# EAGLE schematic AR0130_DEV_BOARD (EAGLE 9.2.2)
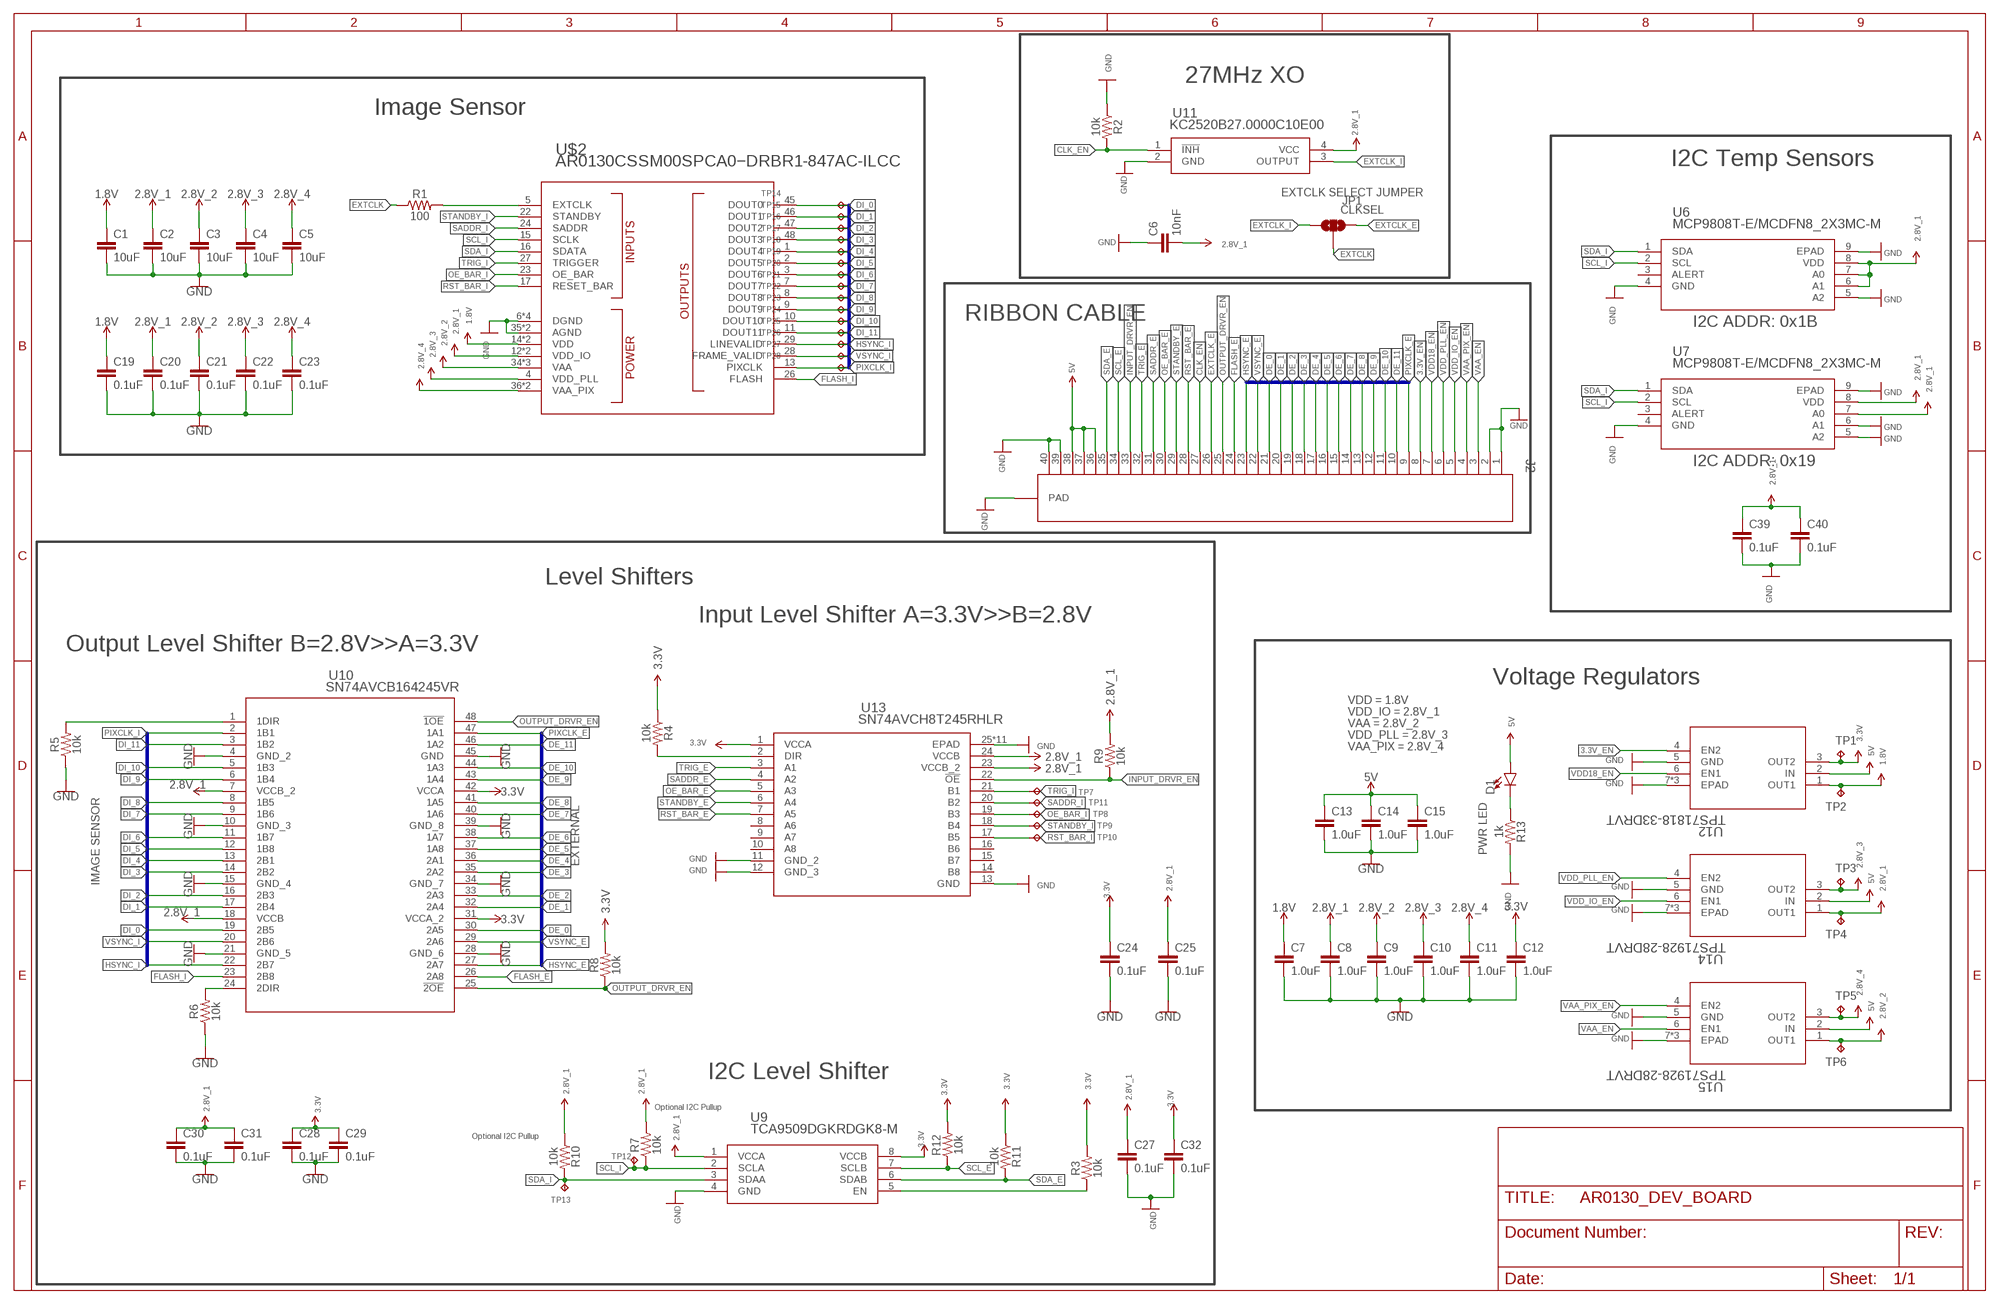
[diagram p0: schematic, sheet 1]

## Parts
C1  10uF  10UF-0603-6.3V-20%  [0603]
C2  10uF  10UF-0603-6.3V-20%  [0603]
C3  10uF  10UF-0603-6.3V-20%  [0603]
C4  10uF  10UF-0603-6.3V-20%  [0603]
C5  10uF  10UF-0603-6.3V-20%  [0603]
C6  10nF  10NF-0402-16V-10%  [0402]
C7  1.0uF  1.0UF-0402-16V-10%  [0402]
C8  1.0uF  1.0UF-0402-16V-10%  [0402]
C9  1.0uF  1.0UF-0402-16V-10%  [0402]
C10  1.0uF  1.0UF-0402-16V-10%  [0402]
C11  1.0uF  1.0UF-0402-16V-10%  [0402]
C12  1.0uF  1.0UF-0402-16V-10%  [0402]
C13  1.0uF  1.0UF-0402-16V-10%  [0402]
C14  1.0uF  1.0UF-0402-16V-10%  [0402]
C15  1.0uF  1.0UF-0402-16V-10%  [0402]
C19  0.1uF  0.1UF-0402-16V-10%  [0402]
C20  0.1uF  0.1UF-0402-16V-10%  [0402]
C21  0.1uF  0.1UF-0402-16V-10%  [0402]
C22  0.1uF  0.1UF-0402-16V-10%  [0402]
C23  0.1uF  0.1UF-0402-16V-10%  [0402]
C24  0.1uF  0.1UF-0402-16V-10%  [0402]
C25  0.1uF  0.1UF-0402-16V-10%  [0402]
C27  0.1uF  0.1UF-0402-16V-10%  [0402]
C28  0.1uF  0.1UF-0402-16V-10%  [0402]
C29  0.1uF  0.1UF-0402-16V-10%  [0402]
C30  0.1uF  0.1UF-0402-16V-10%  [0402]
C31  0.1uF  0.1UF-0402-16V-10%  [0402]
C32  0.1uF  0.1UF-0402-16V-10%  [0402]
C39  0.1uF  0.1UF-0402-16V-10%  [0402]
C40  0.1uF  0.1UF-0402-16V-10%  [0402]
D1  LED0603  [LED-0603]
J2  4-1734592-04-1734592-0  [TE_4-1734592-0]
JP1  CLKSEL  SOLDERJUMPER_2WAYPASTE1&2  [SJ_3_PASTE1&2]
R1  100  RESISTOR0402  [0402]
R2  10k  RESISTOR0402  [0402]
R3  10k  RESISTOR0402  [0402]
R4  10k  RESISTOR0402  [0402]
R5  10k  RESISTOR0402  [0402]
R6  10k  RESISTOR0402  [0402]
R7  10k  RESISTOR0402  [0402]
R8  10k  RESISTOR0402  [0402]
R9  10k  RESISTOR0402  [0402]
R10  10k  RESISTOR0402  [0402]
R11  10k  RESISTOR0402  [0402]
R12  10k  RESISTOR0402  [0402]
R13  1k  RESISTOR0402  [0402]
TP1  TPTP06R  [TP06R]
TP2  TPTP06R  [TP06R]
TP3  TPTP06R  [TP06R]
TP4  TPTP06R  [TP06R]
TP5  TPTP06R  [TP06R]
TP6  TPTP06R  [TP06R]
TP7  TPTP06R  [TP06R]
TP8  TPTP06R  [TP06R]
TP9  TPTP06R  [TP06R]
TP10  TPTP06R  [TP06R]
TP11  TPTP06R  [TP06R]
TP12  TPTP06R  [TP06R]
TP13  TPTP06R  [TP06R]
TP14  TPTP06R  [TP06R]
TP15  TPTP06R  [TP06R]
TP16  TPTP06R  [TP06R]
TP17  TPTP06R  [TP06R]
TP18  TPTP06R  [TP06R]
TP19  TPTP06R  [TP06R]
TP20  TPTP06R  [TP06R]
TP21  TPTP06R  [TP06R]
TP22  TPTP06R  [TP06R]
TP23  TPTP06R  [TP06R]
TP24  TPTP06R  [TP06R]
TP25  TPTP06R  [TP06R]
TP26  TPTP06R  [TP06R]
TP27  TPTP06R  [TP06R]
TP28  TPTP06R  [TP06R]
U6  MCP9808T-E/MCDFN8_2X3MC-M  [DFN8_2X3MC-M]
U7  MCP9808T-E/MCDFN8_2X3MC-M  [DFN8_2X3MC-M]
U9  TCA9509DGKRDGK8-M  [DGK8-M]
U10  SN74AVCB164245VR  [DGV48]
U11  KC2520B27.0000C10E00  [OSC_KYOCERA_KC2520B]
U12  TPS71818-33DRVT  [DRV6_1P6X1]
U13  SN74AVCH8T245RHLR  [RHL24_4P05X2P05]
U14  TPS71928-28DRVT  [DRV6_1P6X1]
U15  TPS71928-28DRVT  [DRV6_1P6X1]
U$2  AR0130CSSM00SPCA0−DRBR1-847AC-ILCC  [AR0130CSSM00SPCA0−DRBR1-847AB]

## Nets
1.8V: C1.1 C7.1 C19.1 TP2.TP U12.1(OUT1) U$2.14(VDD) U$2.19(VDD)
2.8V: C2.1 C6.2 C8.1 C20.1 C25.1 C27.1 C30.1 C31.1 C39.1 C40.1 R7.2 R9.2 R10.1 TP4.TP U6.6(A1) U6.7(A0) U6.8(VDD) U7.7(A0) U7.8(VDD) U9.1(VCCA) U10.7(VCCB_2) U10.18(VCCB) U11.4(VCC) U13.23(VCCB_2) U13.24(VCCB) U14.1(OUT1) U$2.12(VDD_IO) U$2.18(VDD_IO) ; supply symbol labelled 2.8V_1
3.3V: C12.1 C24.1 C28.1 C29.1 C32.1 R3.2 R4.1 R8.2 R11.1 R12.2 TP1.TP U9.8(VCCB) U10.31(VCCA_2) U10.42(VCCA) U12.3(OUT2) U13.1(VCCA)
3.3V_EN: J2.8 U12.4(EN2)
5V: C13.1 C14.1 C15.1 D1.A J2.36 J2.37 J2.38 U12.2(IN) U14.2(IN) U15.2(IN)
CLK_EN: J2.27 R2.2 U11.1(!INH)
DE_0: J2.21 U10.30(2A5)
DE_1: J2.20 U10.32(2A4)
DE_2: J2.19 U10.33(2A3)
DE_3: J2.18 U10.35(2A2)
DE_4: J2.17 U10.36(2A1)
DE_5: J2.16 U10.37(1A8)
DE_6: J2.15 U10.38(1A7)
DE_7: J2.14 U10.40(1A6)
DE_8: J2.13 U10.41(1A5)
DE_9: J2.12 U10.43(1A4)
DE_10: J2.11 U10.44(1A3)
DE_11: J2.10 U10.46(1A2)
DI_0: TP14.TP U10.19(2B5) U$2.45(DOUT0)
DI_1: TP15.TP U10.17(2B4) U$2.46(DOUT1)
DI_2: TP16.TP U10.16(2B3) U$2.47(DOUT2)
DI_3: TP17.TP U10.14(2B2) U$2.48(DOUT3)
DI_4: TP18.TP U10.13(2B1) U$2.1(DOUT4)
DI_5: TP19.TP U10.12(1B8) U$2.2(DOUT5)
DI_6: TP20.TP U10.11(1B7) U$2.3(DOUT6)
DI_7: TP21.TP U10.9(1B6) U$2.7(DOUT7)
DI_8: TP22.TP U10.8(1B5) U$2.8(DOUT8)
DI_9: TP23.TP U10.6(1B4) U$2.9(DOUT9)
DI_10: TP24.TP U10.5(1B3) U$2.10(DOUT10)
DI_11: TP25.TP U10.3(1B2) U$2.11(DOUT11)
EXTCLK: JP1.2 R1.1
EXTCLK_E: J2.26 JP1.3
EXTCLK_I: JP1.1 U11.3(OUTPUT)
FLASH_E: J2.24 U10.26(2A8)
FLASH_I: U10.23(2B8) U$2.26(FLASH)
GND: C1.2 C2.2 C3.2 C4.2 C5.2 C6.1 C7.2 C8.2 C9.2 C10.2 C11.2 C12.2 C13.2 C14.2 C15.2 C19.2 C20.2 C21.2 C22.2 C23.2 C24.2 C25.2 C27.2 C28.2 C29.2 C30.2 C31.2 C32.2 C39.2 C40.2 J2.1 J2.2 J2.39 J2.40 J2.S1(PAD) J2.S2(PAD) R2.1 R5.1 R6.1 R13.2 U6.4(GND) U6.5(A2) U6.9(EPAD) U7.4(GND) U7.5(A2) U7.6(A1) U7.9(EPAD) U9.4(GND) U10.4(GND_2) U10.10(GND_3) U10.15(GND_4) U10.21(GND_5) U10.28(GND_6) U10.34(GND_7) U10.39(GND_8) U10.45(GND) U11.2(GND) U12.5(GND) U12.7(EPAD) U12.8(EPAD) U12.9(EPAD) U13.11(GND_2) U13.12(GND_3) U13.13(GND) U13.25(EPAD) U13.P$1(EPAD) U13.P$2(EPAD) U13.P$3(EPAD) U13.P$4(EPAD) U13.P$5(EPAD) U13.P$6(EPAD) U13.P$7(EPAD) U13.P$8(EPAD) U13.P$9(EPAD) U13.P$10(EPAD) U14.5(GND) U14.7(EPAD) U14.8(EPAD) U14.9(EPAD) U15.5(GND) U15.7(EPAD) U15.8(EPAD) U15.9(EPAD) U$2.6(DGND) U$2.25(DGND) U$2.30(DGND) U$2.35(AGND) U$2.39(AGND) U$2.44(DGND)
HSYNC_E: J2.23 U10.27(2A7)
HSYNC_I: TP26.TP U10.22(2B7) U$2.29(LINEVALID)
INPUT_DRVR_EN: J2.33 R9.1 U13.22(!OE)
N$1: R1.2 U$2.5(EXTCLK)
N$2: D1.C R13.1
N$3: R5.2 U10.1(1DIR)
N$4: R3.1 U9.5(EN)
N$7: R4.2 U13.2(DIR)
N$25: R6.2 U10.24(2DIR)
OE_BAR_E: J2.30 U13.5(A3)
OE_BAR_I: TP8.TP U13.19(B3) U$2.23(OE_BAR)
OUTPUT_DRVR_EN: J2.25 R8.1 U10.25(!2OE) U10.48(!1OE)
PIXCLK_E: J2.9 U10.47(1A1)
PIXCLK_I: TP28.TP U10.2(1B1) U$2.13(PIXCLK)
RST_BAR_E: J2.28 U13.7(A5)
RST_BAR_I: TP9.TP U13.17(B5) U$2.17(RESET_BAR)
SADDR_E: J2.31 U13.4(A2)
SADDR_I: TP11.TP U13.20(B2) U$2.24(SADDR)
SCL_E: J2.34 R12.1 U9.7(SCLB)
SCL_I: R7.1 TP12.TP U6.2(SCL) U7.2(SCL) U9.2(SCLA) U$2.15(SCLK)
SDA_E: J2.35 R11.2 U9.6(SDAB)
SDA_I: R10.2 TP13.TP U6.1(SDA) U7.1(SDA) U9.3(SDAA) U$2.16(SDATA)
STANDBY_E: J2.29 U13.6(A4)
STANDBY_I: TP10.TP U13.18(B4) U$2.22(STANDBY)
TRIG_E: J2.32 U13.3(A1)
TRIG_I: TP7.TP U13.21(B1) U$2.27(TRIGGER)
VAA_EN: J2.3 U15.6(EN1)
VAA_PIX_EN: J2.4 U15.4(EN2)
VCC: C3.1 C9.1 C21.1 TP6.TP U15.1(OUT1) U$2.34(VAA) U$2.38(VAA) U$2.40(VAA) ; supply symbol labelled 2.8V_2
VCC_1: C4.1 C10.1 C22.1 TP3.TP U14.3(OUT2) U$2.4(VDD_PLL) ; supply symbol labelled 2.8V_3
VCC_2: C5.1 C11.1 C23.1 TP5.TP U15.3(OUT2) U$2.36(VAA_PIX) U$2.37(VAA_PIX) ; supply symbol labelled 2.8V_4
VDD18_EN: J2.7 U12.6(EN1)
VDD_IO_EN: J2.5 U14.6(EN1)
VDD_PLL_EN: J2.6 U14.4(EN2)
VSYNC_E: J2.22 U10.29(2A6)
VSYNC_I: TP27.TP U10.20(2B6) U$2.28(FRAME_VALID)
Unconnected: U6.3(ALERT) U7.3(ALERT) U13.8(A6) U13.9(A7) U13.10(A8) U13.14(B8) U13.15(B7) U13.16(B6)

## Buses
DI_[0..11],HSYNC_I,VSYNC_I,PIXCLK_I
DE_[0..11],HSYNC_E,PIXCLK_E,VSYNC_E

## Notes on the sheet
- 27MHz XO
- Image Sensor
- I2C Temp Sensors
- EXTCLK SELECT JUMPER
- RIBBON CABLE
- I2C ADDR: 0x1B
- I2C ADDR: 0x19
- Level Shifters
- Input Level Shifter A=3.3V>>B=2.8V
- Output Level Shifter B=2.8V>>A=3.3V
- Voltage Regulators
- VDD = 1.8V
- VDD_IO = 2.8V_1
- VAA = 2.8V_2
- VDD_PLL = 2.8V_3
- VAA_PIX = 2.8V_4
- EXTERNAL
- PWR LED
- IMAGE SENSOR
- I2C Level Shifter
- Optional I2C Pullup
- Optional I2C Pullup

## Library data of the parts
C1-C5 = SparkFun-Capacitors:10UF: 10.0µF ceramic capacitors A capacitor is a passive two-terminal electrical component used to store electrical energy temporarily in an electric field.; PROD_ID: CAP-11015
C6 = Oliver_Custom:10NF: 10nF ceramic capacitors A capacitor is a passive two-terminal electrical component used to store electrical energy temporarily in an electric field.; PROD_ID: CAP-12416
C7-C15 = SparkFun-Capacitors:1.0UF: 1µF ceramic capacitors A capacitor is a passive two-terminal electrical component used to store electrical energy temporarily in an electric field.; PROD_ID: CAP-12417
C19-C25 C27-C32 C39 C40 = SparkFun-Capacitors:0.1UF: 0.1µF ceramic capacitors A capacitor is a passive two-terminal electrical component used to store electrical energy temporarily in an electric field.; PROD_ID: CAP-12416
D1 = SparkFun-LED:LED: LED (Generic) Standard schematic elements and footprints for 5mm, 3mm, 1206, and 0603 sized LEDs. Generic LEDs with no color specified.
J2 = Oliver_Custom:4-1734592-0
JP1 = SparkFun-Passives:SOLDERJUMPER_2WAY: Solder Jumper 2 way solder jumper
R1-R13 = SparkFun-Resistors:RESISTOR: Generic Resistor Package
TP1-TP28 = testpad:TP: Test pad
U6 U7 = Oliver_Custom:MCP9808T-E/MC; MANUFACTURER_PART_NUMBER: MCP9808TEMC; VENDOR: Microchip
U9 = Oliver_Custom:TCA9509DGKR; MANUFACTURER_PART_NUMBER: TCA9509DGKR; VENDOR: Texas Instruments
U10 = Oliver_Custom:SN74AVCB164245VR; MANUFACTURER_PART_NUMBER: SN74AVCB164245VR; VENDOR: Texas Instruments
U11 = Oliver_Custom:KC2520B27.0000C10E00; MANUFACTURER_PART_NUMBER: KC2520B27.0000C10E00; VENDOR: Kyocera
U12 = Oliver_Custom:TPS71818-33DRVT; MANUFACTURER_PART_NUMBER: TPS7181833DRVT; VENDOR: Texas Instruments
U13 = Oliver_Custom:SN74AVCH8T245RHLR; MANUFACTURER_PART_NUMBER: SN74AVCH8T245RHLR; VENDOR: Texas Instruments
U14 U15 = Oliver_Custom:TPS71928-28DRVT; MANUFACTURER_PART_NUMBER: TPS7192828DRVT; VENDOR: Texas Instruments
U$2 = Oliver_Custom:AR0130CSSM00SPCA0−DRBR1-847AC-ILCC